# Altium schematic sheet GPIO_Expander.SchDoc
size A; SheetNumber: 6; SheetTotal: 11
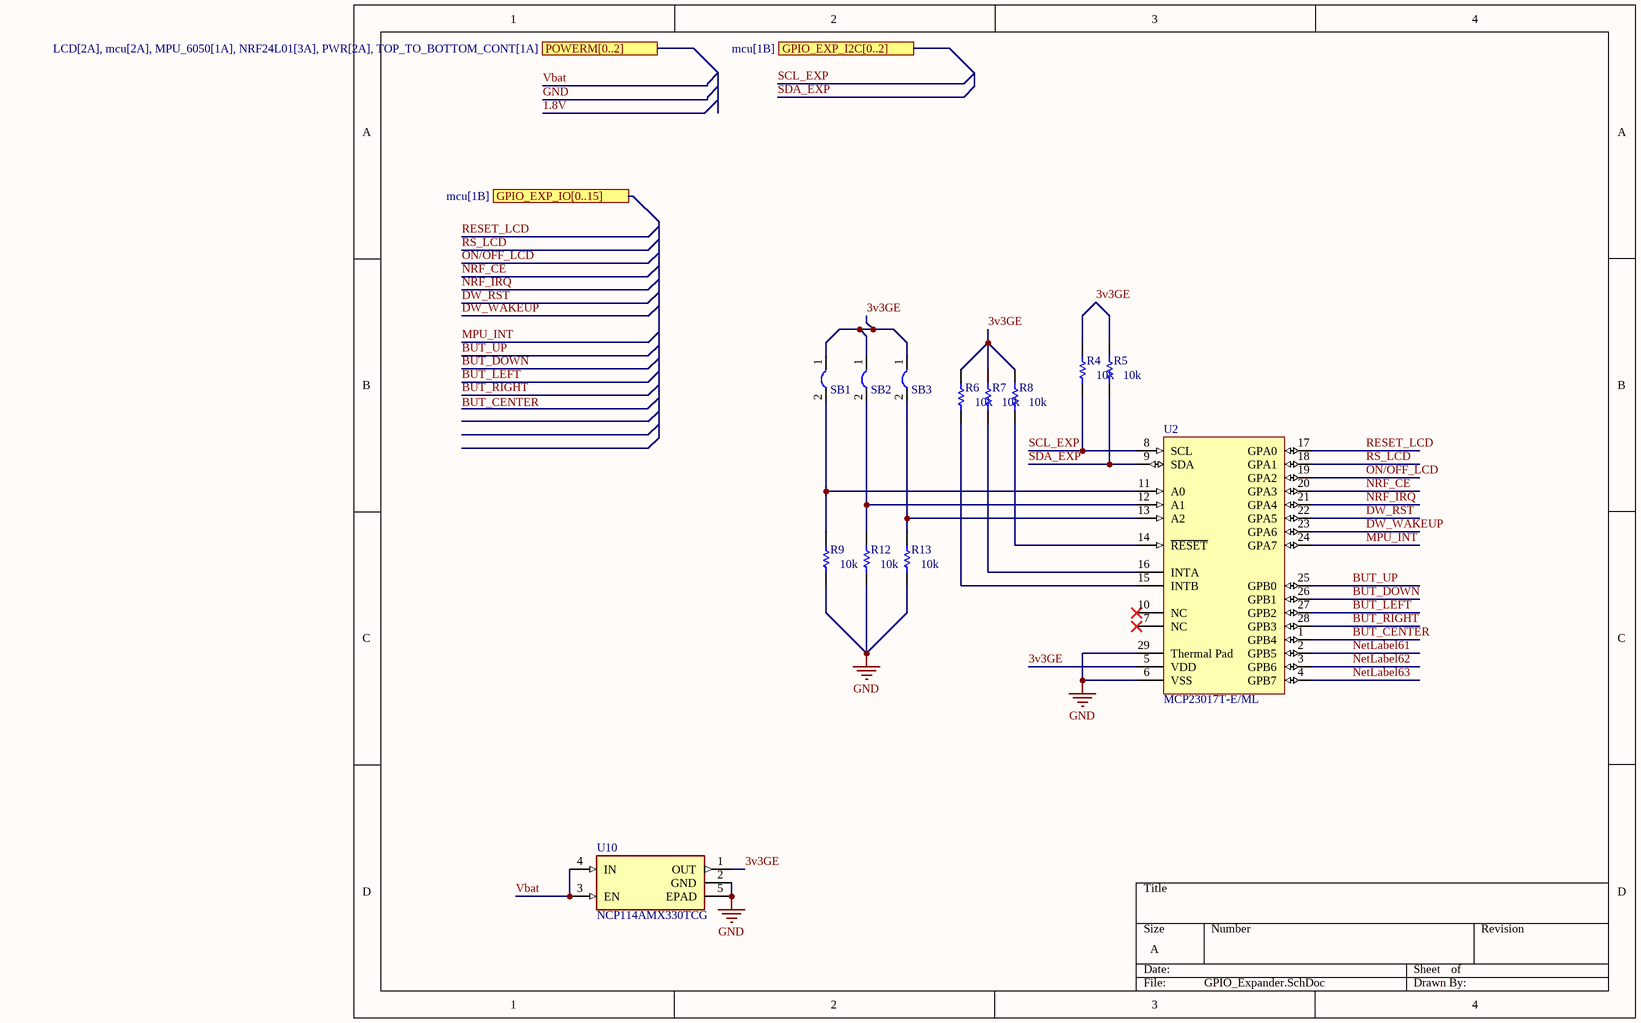
[diagram p0: GPIO_Expander.SchDoc]

## Parts
R4  resistance: 10k  [RESC1005X40X25LL05T10]  (hidden comment: 0402WGF1002TCE)
R5  resistance: 10k  [RESC1005X40X25LL05T10]  (hidden comment: 0402WGF1002TCE)
R6  resistance: 10k  [RESC1005X40X25LL05T10]  (hidden comment: 0402WGF1002TCE)
R7  resistance: 10k  [RESC1005X40X25LL05T10]  (hidden comment: 0402WGF1002TCE)
R8  resistance: 10k  [RESC1005X40X25LL05T10]  (hidden comment: 0402WGF1002TCE)
R9  resistance: 10k  [RESC1005X40X25LL05T10]  (hidden comment: 0402WGF1002TCE)
R12  resistance: 10k  [RESC1005X40X25LL05T10]  (hidden comment: 0402WGF1002TCE)
R13  resistance: 10k  [RESC1005X40X25LL05T10]  (hidden comment: 0402WGF1002TCE)
SB1  Jumper  [Jumper]  (value not drawn)
SB2  Jumper  [Jumper]  (value not drawn)
SB3  Jumper  [Jumper]  (value not drawn)
U2  MCP23017T-E/ML  [QFN-ML28_M]
U10  NCP114AMX330TCG  [REG_NCP114AMX330TCG]

## Ports
GPIO_EXP_I2C[0..2] (see mcu[1B]), GPIO_EXP_IO[0..15] (see mcu[1B]), POWERM[0..2] (see LCD[2A], mcu[2A], MPU_6050[1A], NRF24L01[3A], PWR[2A], TOP_TO_BOTTOM_CONT[1A])

## Nets
GND: R9.1 R12.1 R13.1 U2.6(VSS) U2.29(Thermal_Pad) U10.2(GND) U10.5(EPAD)
3v3GE: R4.2 R5.2 R6.2 R7.2 R8.2 SB1.1 SB2.1 SB3.1 U2.5(VDD) U10.1(OUT)
BUT_CENTER: U2.1(GPB4)
BUT_DOWN: U2.26(GPB1)
BUT_LEFT: U2.27(GPB2)
BUT_RIGHT: U2.28(GPB3)
BUT_UP: U2.25(GPB0)
DW_RST: U2.22(GPA5)
DW_WAKEUP: U2.23(GPA6)
MPU_INT: U2.24(GPA7)
NetLabel61: U2.2(GPB5)
NetLabel62: U2.3(GPB6)
NetLabel63: U2.4(GPB7)
NRF_CE: U2.20(GPA3)
NRF_IRQ: U2.21(GPA4)
ON/OFF_LCD: U2.19(GPA2)
RESET_LCD: U2.17(GPA0)
RS_LCD: U2.18(GPA1)
SCL_EXP: R4.1 U2.8(SCL)
SDA_EXP: R5.1 U2.9(SDA)
Vbat: U10.3(EN) U10.4(IN)
NetR6_1: R6.1 U2.15(INTB)
NetR7_1: R7.1 U2.16(INTA)
NetR8_1: R8.1 U2.14(~{RESET})
NetR9_2: R9.2 SB1.2 U2.11(A0)
NetR12_2: R12.2 SB2.2 U2.12(A1)
NetR13_2: R13.2 SB3.2 U2.13(A2)

Not connected (* = marked no-connect by the designer): U2 7(NC)* 10(NC)*

## Notes on the sheet
- Labels drawn without touching a wire or pin: BUT_CENTER

## Library data of the parts
R4-R9 R12 R13 = CMP-2002-03043-1: Manufacturer: UNI-ROYAL(Uniroyal Elec); JLCPCB Part #: C25744; MFR.Part #: 0402WGF1002TCE
U2 = CMP-0186-00119-2: 16-Bit I/O Expander with Serial Interface, 28-Pin QFN, Extended Temperature, Tape and Reel; Manufacturer: Microchip Tech; ComponentLink3Description: Package Specification; ComponentLink2URL: http://ww1.microchip.com/downloads/en/DeviceDoc/21952b.pdf; ComponentLink2Description: Datasheet; ComponentLink1URL: http://www.microchip.com/; ComponentLink3URL: http://www.microchip.com/stellent/groups/techpub_sg/documents/packagingspec/en012702.pdf; ComponentLink1Description: Manufacturer URL; JLCPCB Part #: C629439; MFR.Part #: MCP23017T-E/ML
U10 = NCP114AMX330TCG: Linear Voltage Regulator IC Positive Fixed 1 Output 300mA 4-UDFN (1.0x1.0); Manufacturer: onsemi; MFR.Part #: NCP114AMX330TCG; JLCPCB Part #: C133056